# Altium schematic sheet CMX655D_Audio_CODEC_PA.SchDoc: CMX655D Audio CODEC with PA
size A4; DocumentNumber: 6; SheetNumber: 6; SheetTotal: 31
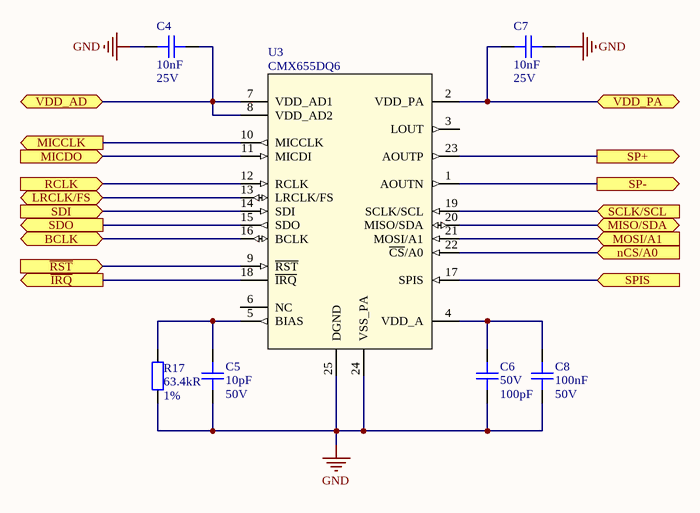
[diagram p0: CMX655D_Audio_CODEC_PA.SchDoc]

## Parts
C4  Capacitance: 10nF  Voltage: 25V  [C0402]  (hidden comment: CAP CER 10nF 25V X7R 10% 0402)
C5  Capacitance: 10pF  Voltage Rating: 50V  [C0402]  (hidden comment: CAP CER 10PF 50V C0G/NP0 0402)
C6  Voltage: 50V  Capacitance: 100pF  [CAP_0402]  (hidden comment: C 100pF 50V C0G, NP0 0402)
C7  Capacitance: 10nF  Voltage: 25V  [C0402]  (hidden comment: CAP CER 10nF 25V X7R 10% 0402)
C8  Capacitance: 100nF  Voltage: 50V  [C0402]  (hidden comment: CAP CER 0.1UF 50V X7R 0402)
R17  Resistance: 63.4kR  Tolerance: 1%  [R_0402]  (hidden comment: RES SMD 63.4K OHM 1% 1/16W 0402)
U3  CMX655DQ6  [QFN50P400X400X100_HS-25N]

## Ports
BCLK (bidir), LRCLK/FS (bidir), MICCLK (out), MICDO (in), MISO/SDA (bidir), MOSI/A1 (in), nCS/A0 (in), RCLK (in), SCLK/SCL (in), SDI (in), SDO (out), SP+ (out), SP- (out), SPIS (in), VDD_AD, VDD_PA, ~{IRQ} (out), ~{RST} (in)

## Nets
GND: C4.1 C5.1 C6.1 C7.1 C8.1 R17.2 U3.24(VSS_PA) U3.25(DGND)
~{IRQ}: U3.18(~{IRQ}) ; port ~{IRQ}
~{RST}: U3.9(~{RST}) ; port ~{RST}
BCLK: U3.16(BCLK) ; port BCLK
LRCLK/FS: U3.13(LRCLK/FS) ; port LRCLK/FS
MICCLK: U3.10(MICCLK) ; port MICCLK
MICDO: U3.11(MICDI) ; port MICDO
MISO/SDA: U3.20(MISO/SDA) ; port MISO/SDA
MOSI/A1: U3.21(MOSI/A1) ; port MOSI/A1
nCS/A0: U3.22(~{CS}/A0) ; port nCS/A0
RCLK: U3.12(RCLK) ; port RCLK
SCLK/SCL: U3.19(SCLK/SCL) ; port SCLK/SCL
SDI: U3.14(SDI) ; port SDI
SDO: U3.15(SDO) ; port SDO
SP+: U3.23(AOUTP) ; port SP+
SP-: U3.1(AOUTN) ; port SP-
SPIS: U3.17(SPIS) ; port SPIS
VDD_AD: C4.2 U3.7(VDD_AD1) U3.8(VDD_AD2) ; port VDD_AD
VDD_PA: C7.2 U3.2(VDD_PA) ; port VDD_PA
NetC5_2: C5.2 R17.1 U3.5(BIAS)
NetC6_2: C6.2 C8.2 U3.4(VDD_A)

Not connected (* = marked no-connect by the designer): U3 3(LOUT) 6(NC)

## Notes on the sheet
- Title
- Size:
- Date:
- A4
- Number:
- Time:
- Revision:
- Sheet
- of
- File:

## Library data of the parts
C4 C7 = CAP CER 10nF 25V X7R 10% 0402: Manufacturer: Kyocera AVX; Manufacturer Part Number: 04023C103KAT2A; Dissipation Factor: 12.5%; Insulation Resistance: 100GR; Supplier 1: Digi-Key; Stock 1: 1015537; Pricing 1: 1=0.1, 10=0.034, 50=0.0182, 100=0.0149, 500=0.0107, 1000=0.0084, 2500=0.0076, 5000=0.007 (USD); Mount: Surface Mount,PCB; Case/Package: 0402; Case Code (Metric): 1005; Case Code (Imperial): 0402; Min Operating Temperature: -55°C; Max Operating Temperature: 125°C; Tolerance: 10%; Dielectric: X7R; Voltage Rating (DC): 25V; Packaging: Tape and Reel; Voltage Rating: 25V; Package Quantity: 1; Termination: SMD/SMT; Length: 1mm; Height: 0.56mm; Depth: 0.5mm; Width: 0.02inch; Thickness: 0.022inch; Radiation Hardening: No; REACH SVHC: No SVHC; Lead Free: Lead Free; ComponentLink1URL: http://www.farnell.com/datasheets/2237835.pdf?src-supplier=Element14; ComponentLink1Description: http://www.farnell.com/datasheets/2237835.pdf?src-supplier=Element14; ComponentLink2URL: http://catalogs.avx.com/SurfaceMount.pdf?src-supplier=Digi-Key; ComponentLink2Description: http://catalogs.avx.com/SurfaceMount.pdf?src-supplier=Digi-Key; ComponentLink3URL: http://www.alliedelec.com/m/d/a24bb5190bea413b2ff164816f55e87c.pdf?src-supplier=Allied+Electronics; ComponentLink3Description: http://www.alliedelec.com/m/d/a24bb5190bea413b2ff164816f55e87c.pdf?src-supplier=Allied+Electronics; ComponentLink4URL: http://uk.rs-online.com/webdocs/13ec/0900766b813ece35.pdf?src-supplier=RSComponents; ComponentLink4Description: http://uk.rs-online.com/webdocs/13ec/0900766b813ece35.pdf?src-supplier=RSComponents; Supplier Part Number 1: 478-1113-1-ND
C5 = CAP CER 10PF 50V C0G/NP0 0402: 10pF ±10% 50V Ceramic Capacitor C0G, NP0 0402 (1005 Metric); Manufacturer: KEMET; Manufacturer Part Number: C0402C100K5GACTU; Dissipation Factor: 0.1%; Supplier 1: Digi-Key; Stock 1: 57093; Pricing 1: 1=0.1, 10=0.021, 50=0.0116, 100=0.0095, 500=0.0068, 1000=0.0053, 2500=0.0048, 5000=0.0045 (USD); Mount: Surface Mount; Case/Package: 0402; Case Code (Metric): 1005; Case Code (Imperial): 0402; Dielectric Material: Ceramic; Min Operating Temperature: -55°C; Max Operating Temperature: 125°C; Tolerance: 10%; Packaging: Tape and Reel; Package Quantity: 10000; Voltage Rating (DC): 50V; Dielectric: C0G; Termination: SMD/SMT; Length: 1mm; Height: 0.5mm; Width: 0.02inch; Thickness: 0.022inch; Lead Pitch: 0.3mm; Depth: 0.5mm; Radiation Hardening: No; REACH SVHC: No SVHC; Lead Free: Lead Free; ComponentLink1URL: http://www.mouser.com/ds/2/212/KEM_C1003_C0G_SMD-1101588.pdf?src-supplier=Mouser; ComponentLink1Description: http://www.mouser.com/ds/2/212/KEM_C1003_C0G_SMD-1101588.pdf?src-supplier=Mouser; Supplier Part Number 1: 399-7747-1-ND
C6 = C 100pF 50V C0G, NP0 0402: 100pF ±5% 50V Ceramic Capacitor C0G, NP0 0402 (1005 Metric); Manufacturer: Yageo; Manufacturer Part Number: CC0402JRNPO9BN101; Temperature Coefficient: 30ppm/°C; Insulation Resistance: 100GR; Supplier 1: Digi-Key; Stock 1: 4235236; Pricing 1: 1=0.1, 10=0.02, 100=0.0089, 500=0.0064, 1000=0.005, 2500=0.0046, 5000=0.0042 (USD); Mount: Surface Mount; Case/Package: 0402; Number of Pins: 2; Case Code (Imperial): 0402; Case Code (Metric): 1005; Dielectric Material: Ceramic; Min Operating Temperature: -55°C; Max Operating Temperature: 125°C; Tolerance: 5%; Voltage Rating (DC): 50V; Packaging: Tape and Reel; Package Quantity: 1; Termination: SMD/SMT; Composition: Ceramic; Length: 1mm; Height: 0.5mm; Width: 0.5mm; Thickness: 0.022inch; Depth: 0.5mm; Radiation Hardening: No; REACH SVHC: No SVHC; Lead Free: Lead Free; ComponentLink1URL: http://www.farnell.com/datasheets/2213336.pdf?src-supplier=Newark; ComponentLink1Description: http://www.farnell.com/datasheets/2213336.pdf?src-supplier=Newark; ComponentLink2URL: http://www.yageo.com/documents/recent/UPY-GP_NP0_16V-to-50V_16.pdf?src-supplier=Digi-Key; ComponentLink2Description: http://www.yageo.com/documents/recent/UPY-GP_NP0_16V-to-50V_16.pdf?src-supplier=Digi-Key; ComponentLink3URL: http://documents.rs-components.com/techlib://itc_doclist_GB.htm?stockno=6698684&src-supplier=RSComponents; ComponentLink3Description: http://documents.rs-components.com/techlib://itc_doclist_GB.htm?stockno=6698684&src-supplier=RSComponents; ComponentLink4URL: http://www.yageo.com/documents/recent/UPY-GP_NP0_16V-to-50V_8.pdf?src-supplier=Avnet+Europe; ComponentLink4Description: http://www.yageo.com/documents/recent/UPY-GP_NP0_16V-to-50V_8.pdf?src-supplier=Avnet+Europe; ComponentLink5URL: http://www.farnell.com/datasheets/1443161.pdf?src-supplier=Element14; ComponentLink5Description: http://www.farnell.com/datasheets/1443161.pdf?src-supplier=Element14; ComponentLink6URL: http://www.farnell.com/datasheets/2213336.pdf?src-supplier=Element14; ComponentLink6Description: http://www.farnell.com/datasheets/2213336.pdf?src-supplier=Element14; Supplier Part Number 1: 311-1024-1-ND; Dielectric: C0G; Voltage Rating: 50V
C8 = CAP CER 0.1UF 50V X7R 0402: 0.1µF ±10% 50V Ceramic Capacitor X7R 0402 (1005 Metric); Manufacturer: TDK; Manufacturer Part Number: CGA2B3X7R1H104K050BB; Supplier 1: Digi-Key; Stock 1: 2925303; Pricing 1: 1=0.17, 10=0.118, 50=0.0668, 100=0.0553, 500=0.0388, 1000=0.0321, 2500=0.0299, 5000=0.0273 (USD); Mount: Surface Mount; Case/Package: 0402; Weight: 2.3E-05oz; Case Code (Metric): 1005; Case Code (Imperial): 0402; Min Operating Temperature: -55°C; Max Operating Temperature: 125°C; Voltage Rating: 50V; Tolerance: 10%; Packaging: Tape and Reel; Package Quantity: 1; Voltage Rating (DC): 50V; Dielectric: X7R; Termination: SMD/SMT; Composition: Ceramic; Length: 1mm; Height: 0.5mm; Width: 0.02inch; Thickness: 0.022inch; Depth: 0.5mm; Ratings: AEC-Q200; REACH SVHC: No SVHC; Lead Free: Lead Free; ComponentLink1URL: http://product.tdk.com/capacitor/mlcc/en/documents/mlccspec_automotive_general_midvoltage_en.pdf?src-supplier=Future+Electronics; ComponentLink1Description: http://product.tdk.com/capacitor/mlcc/en/documents/mlccspec_automotive_general_midvoltage_en.pdf?src-supplier=Future+Electronics; ComponentLink2URL: http://www.farnell.com/datasheets/1807242.pdf?src-supplier=Element14; ComponentLink2Description: http://www.farnell.com/datasheets/1807242.pdf?src-supplier=Element14; ComponentLink3URL: http://www.mouser.com/ds/2/400/lcc_automotive_general_en-843974.pdf?src-supplier=Mouser; ComponentLink3Description: http://www.mouser.com/ds/2/400/lcc_automotive_general_en-843974.pdf?src-supplier=Mouser; ComponentLink4URL: http://www.farnell.com/datasheets/1936565.pdf?src-supplier=Element14; ComponentLink4Description: http://www.farnell.com/datasheets/1936565.pdf?src-supplier=Element14; ComponentLink5URL: http://www.farnell.com/datasheets/1735392.pdf?src-supplier=Element14; ComponentLink5Description: http://www.farnell.com/datasheets/1735392.pdf?src-supplier=Element14; Supplier Part Number 1: 445-6899-1-ND
R17 = RES SMD 63.4K OHM 1% 1/16W 0402: 63.4 kOhms ±1% 0.063W, 1/16W Chip Resistor 0402 (1005 Metric) Moisture Resistant Thick Film; Manufacturer: Yageo; Manufacturer Part Number: RC0402FR-0763K4L; Power Rating: 62.5mW; Voltage Rating: 50V; Temperature Coefficient: 100ppm/°C; Max Power Dissipation: 63mW; Supplier 1: Digi-Key; Stock 1: 453897; Pricing 1: 1=0.1, 10=0.015, 100=0.0062, 1000=0.0028, 2500=0.0024, 5000=0.002 (USD); Case/Package: 0402; Case Code (Imperial): 0402; Case Code (Metric): 1005; Contact Plating: Tin,Matte; Min Operating Temperature: -55°C; Max Operating Temperature: 155°C; Packaging: Tape and Reel; Composition: Thick Film; Number of Terminations: 2; Termination: SMD/SMT; Military Standard: Not; Features: Moisture Resistant; Length: 1mm; Height: 0.016inch; Width: 0.02inch; Depth: 0.5mm; Lead Free: Lead Free; ComponentLink1URL: http://www.yageo.com/documents/recent/PYu-RC0402_51_RoHS_L_6.pdf?src-supplier=Avnet+Europe; ComponentLink1Description: http://www.yageo.com/documents/recent/PYu-RC0402_51_RoHS_L_6.pdf?src-supplier=Avnet+Europe; ComponentLink2URL: http://www.yageo.com/documents/recent/PYu-RC0402_51_RoHS_L_6_r.pdf?src-supplier=Future+Electronics; ComponentLink2Description: http://www.yageo.com/documents/recent/PYu-RC0402_51_RoHS_L_6_r.pdf?src-supplier=Future+Electronics; ComponentLink3URL: http://www.yageo.com/documents/recent/PYu-RC0402_51_RoHS_L_6.pdf?src-supplier=Avnet; ComponentLink3Description: http://www.yageo.com/documents/recent/PYu-RC0402_51_RoHS_L_6.pdf?src-supplier=Avnet; Supplier Part Number 1: YAG3204CT-ND
U3 = IC CMX655DQ6-TR1K VOICE CODEC 16BIT 24VQFN: Voice-Band Interface 16 b I²S, PCM, SPI 24-VQFN (4x4); Manufacturer: CML Microcircuits; Supplier 1: Mouser; Manufacturer Part Number: CMX655DQ6; Stock 1: 164; Pricing 1: 1=1.41, 10=1.41, 50=1.36, 100=1.22, 1000=1.07, 10000=1.01 (USD); Mount: Surface Mount; Case/Package: VQFN; Packaging: Cut Tape; ComponentLink1URL: https://www.cmlmicro.com/wp-content/uploads/2018/10/CMX655_ds.pdf?src-supplier=Digi-Key; ComponentLink1Description: https://www.cmlmicro.com/wp-content/uploads/2018/10/CMX655_ds.pdf?src-supplier=Digi-Key; Supplier Part Number 1: 226-CMX655DQ6; Supplier 2: Digi-Key; Supplier Part Number 2: 2032-1036-1-ND